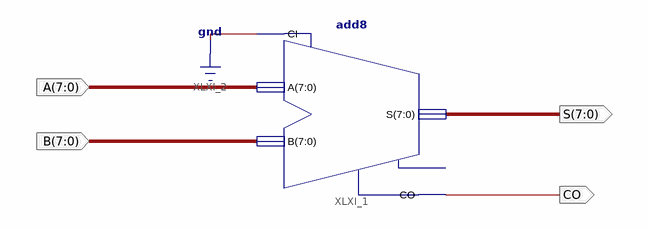
[diagram p0: schematic sheet 1]
// Xilinx ISE schematic Processor.sch (spartan6) as structural Verilog: 1 symbols, 4 ports
module Processor (
  input  [7:0] A,
  input  [7:0] B,
  output [7:0] S,
  output CO
);

  add8 XLXI_1 (.A(A), .B(B), .CI(1'b0), .CO(CO), .S(S));  // open: OFL
endmodule
